# Altium schematic sheet layout2.SchDoc
size A4; SheetNumber: 2; SheetTotal: 2
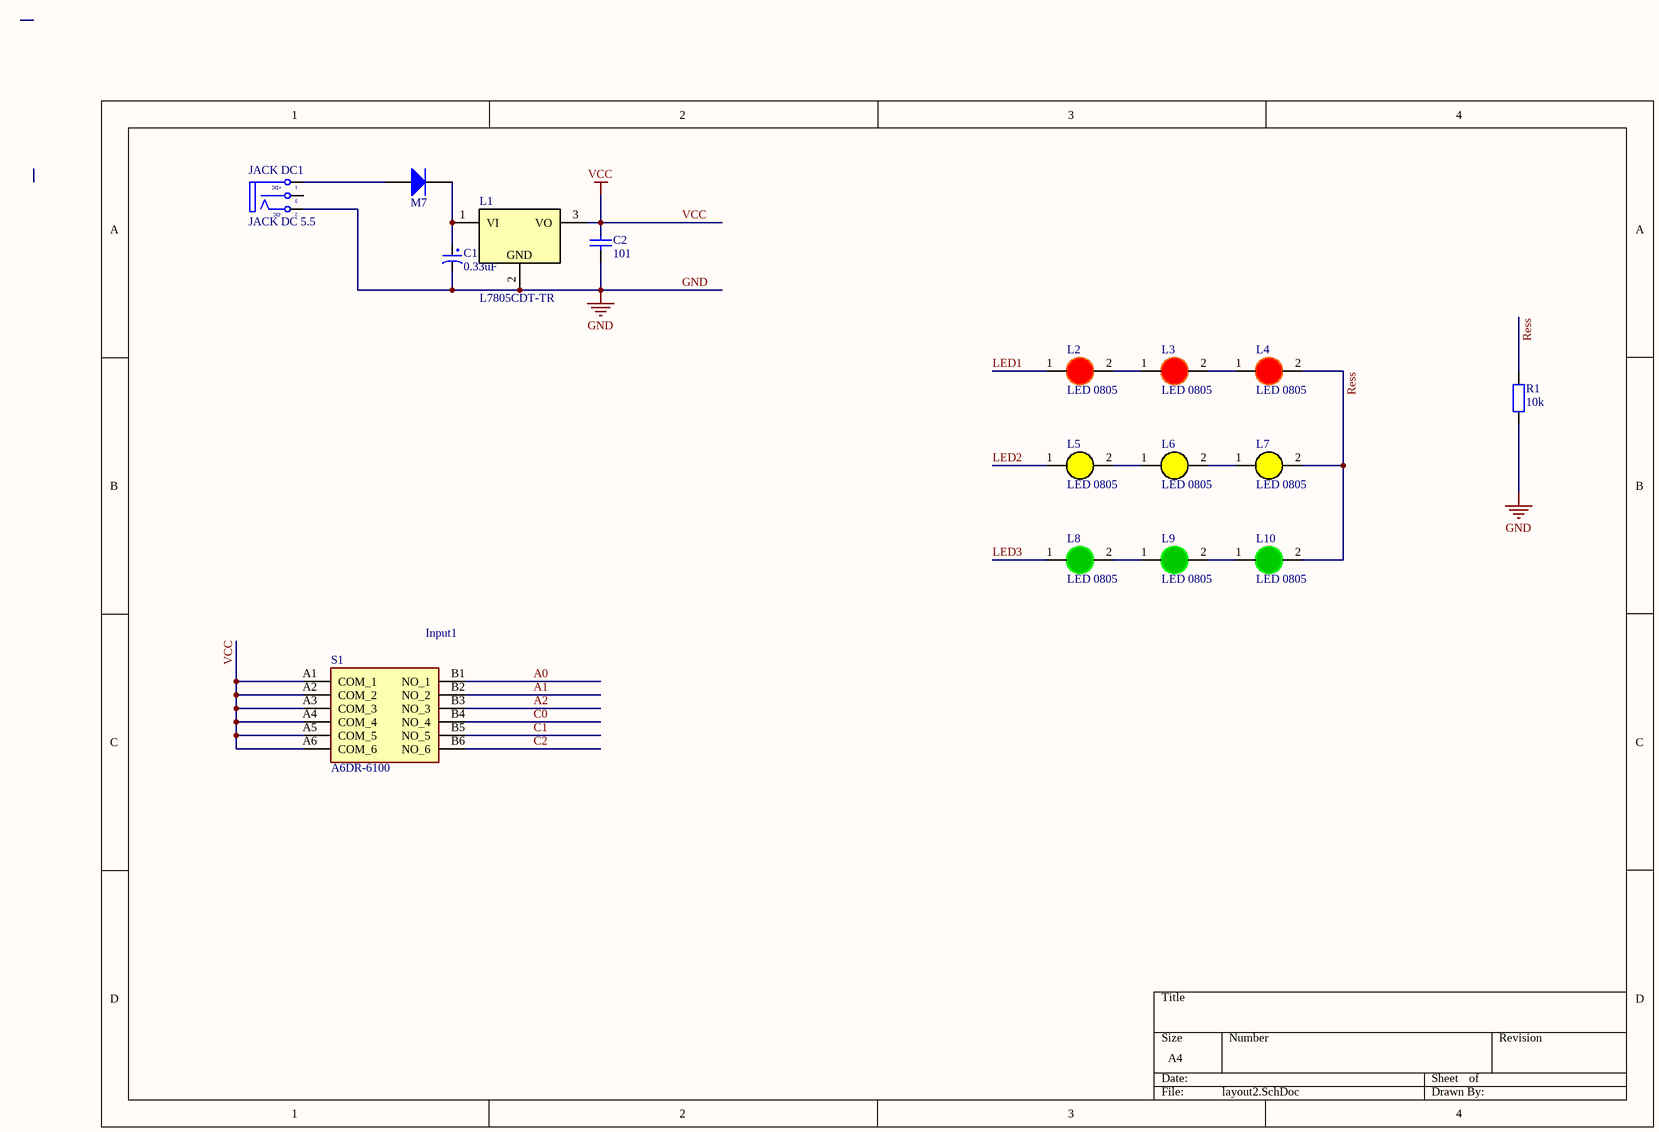
[diagram p0: layout2.SchDoc]

## Parts
?  M7  [DIODE SMA]
C1  0.33uF  [tu hoa 5mm]
C2  101  [tu 0603]
JACK_DC1  JACK DC 5.5  [JACK DC 5.5]
L1  L7805CDT-TR  [DPAK_118_446_112X59_SMD]
L2  LED 0805  [LED-1206-Red]
L3  LED 0805  [LED-1206-Red]
L4  LED 0805  [LED-1206-Red]
L5  LED 0805  [LED-0805-Yellow]
L6  LED 0805  [LED-0805-Yellow]
L7  LED 0805  [LED-0805-Yellow]
L8  LED 0805  [LED-0805-Green]
L9  LED 0805  [LED-0805-Green]
L10  LED 0805  [LED-0805-Green]
R1  10k  [tro smd 0603]
S1  A6DR-6100  [A6DR6100]

## Nets
GND: C1.2 C2.2 JACK_DC1.2(TN) L1.2 R1.1
VCC: C2.1 L1.3(VO) S1.A1(COM_1) S1.A2(COM_2) S1.A3(COM_3) S1.A4(COM_4) S1.A5(COM_5) S1.A6(COM_6)
A0: S1.B1(NO_1)
A1: S1.B2(NO_2)
A2: S1.B3(NO_3)
C0: S1.B4(NO_4)
C1: S1.B5(NO_5)
C2: S1.B6(NO_6)
LED1: L2.1(A)
LED2: L5.1(A)
LED3: L8.1(A)
Ress: L4.2(K) L7.2(K) L10.2(K) R1.2
Net?_1: ?.1(A) JACK_DC1.1(T)
Net?_2: ?.2(K) C1.1 L1.1(VI)
NetL2_2: L2.2(K) L3.1(A)
NetL3_2: L3.2(K) L4.1(A)
NetL5_2: L5.2(K) L6.1(A)
NetL6_2: L6.2(K) L7.1(A)
NetL8_2: L8.2(K) L9.1(A)
NetL9_2: L9.2(K) L10.1(A)

Not connected (* = marked no-connect by the designer): JACK_DC1 3(S)

## Notes on the sheet
- (near S1) Input1
- (in symbol JACK DC 5.5) +DC; -DC
- (in symbol REG_35V_5V-1.5A-7.5W-DPAK) GND

## Library data of the parts
? = Diode M7 ( 4007 ): Dán; Don_Vi: Con; Ten_Linh_Kien: Diode M7 1N4007 SMD 1A 1000V; Ma_Hang: MH000944; Chung_Loai: Dán; Ghi_Chu: *
C1 = Tu Hoa 0.33uF 50V 5x11: Cắm; Don_Vi: Con; So_Chan: 2; Ten_Linh_Kien: Tụ Hóa 0.33uF 50V 5x11MM; Ma_Hang: MH004655; Chung_Loai: Cắm; Kieu_Chan: *
C2 = Tu 0603 101 50V 10%: Dán; Don_Vi: Con; So_Chan: 2; Ten_Linh_Kien: Tụ 0603 101-0.1nF 10% 50V; Ma_Hang: MH004565; Chung_Loai: Dán; Kieu_Chan: *
JACK_DC1 = JACK DC 5.5: Value: Jac DC
L1 = REG_35V_5V-1.5A-7.5W-DPAK: Linear Voltage Regulator IC 1 Output 1.5A DPAK; Manufacturer: Diodes; Alternate Part Number-1: CJ7805 3%; Manufacturer Part Number: L7805CDT-TR; Case/Package: DPAK; Supplier-1: SP ROAD; Supplier Part Number-1: L7805CDT-TR
L2-L4 = LED 1206 Do: Dán; Don_Vi: Con; Ma_Hang: MH002334; Ten_Linh_Kien: LED1206 Màu Đỏ (Red); Ghi_Chu: *; Kieu_Chan: *; Chung_Loai: Dán
L5-L7 = LED 0805 Vang: Dán; Don_Vi: Con; Ma_Hang: MH002329; Ten_Linh_Kien: LED 0805 Màu Vàng ( Yellow); Ghi_Chu: *; Kieu_Chan: *; Chung_Loai: Dán
L8-L10 = LED 0805 Xanh La: Dán; Don_Vi: Con; Ma_Hang: MH002326; Ten_Linh_Kien: LED 0805 Màu Xanh Lá (Green); Ghi_Chu: *; Kieu_Chan: *; Chung_Loai: Dán
R1 = Tro 0603 5% 10k: Dán; Don_Vi: Con; So_Chan: 2; Ten_Linh_Kien: Trở 0603 5% 10k; Ma_Hang: MH006316; Chung_Loai: Dán; Kieu_Chan: *
S1 = A6DR-6100: Switch; Manufacturer_Name: OMRON Electronics; Datasheet Link: https://componentsearchengine.com/Datasheets/2/A6DR-6100.pdf; Height: 7.4mm; Manufacturer_Part_Number: A6DR-6100; Mouser Part Number: 653-A6DR-6100; Mouser Price/Stock: https://www.mouser.co.uk/ProductDetail/Omron-Electronics/A6DR-6100?qs=Pjd0UV7BHP9H24KYn64LLg%3D%3D